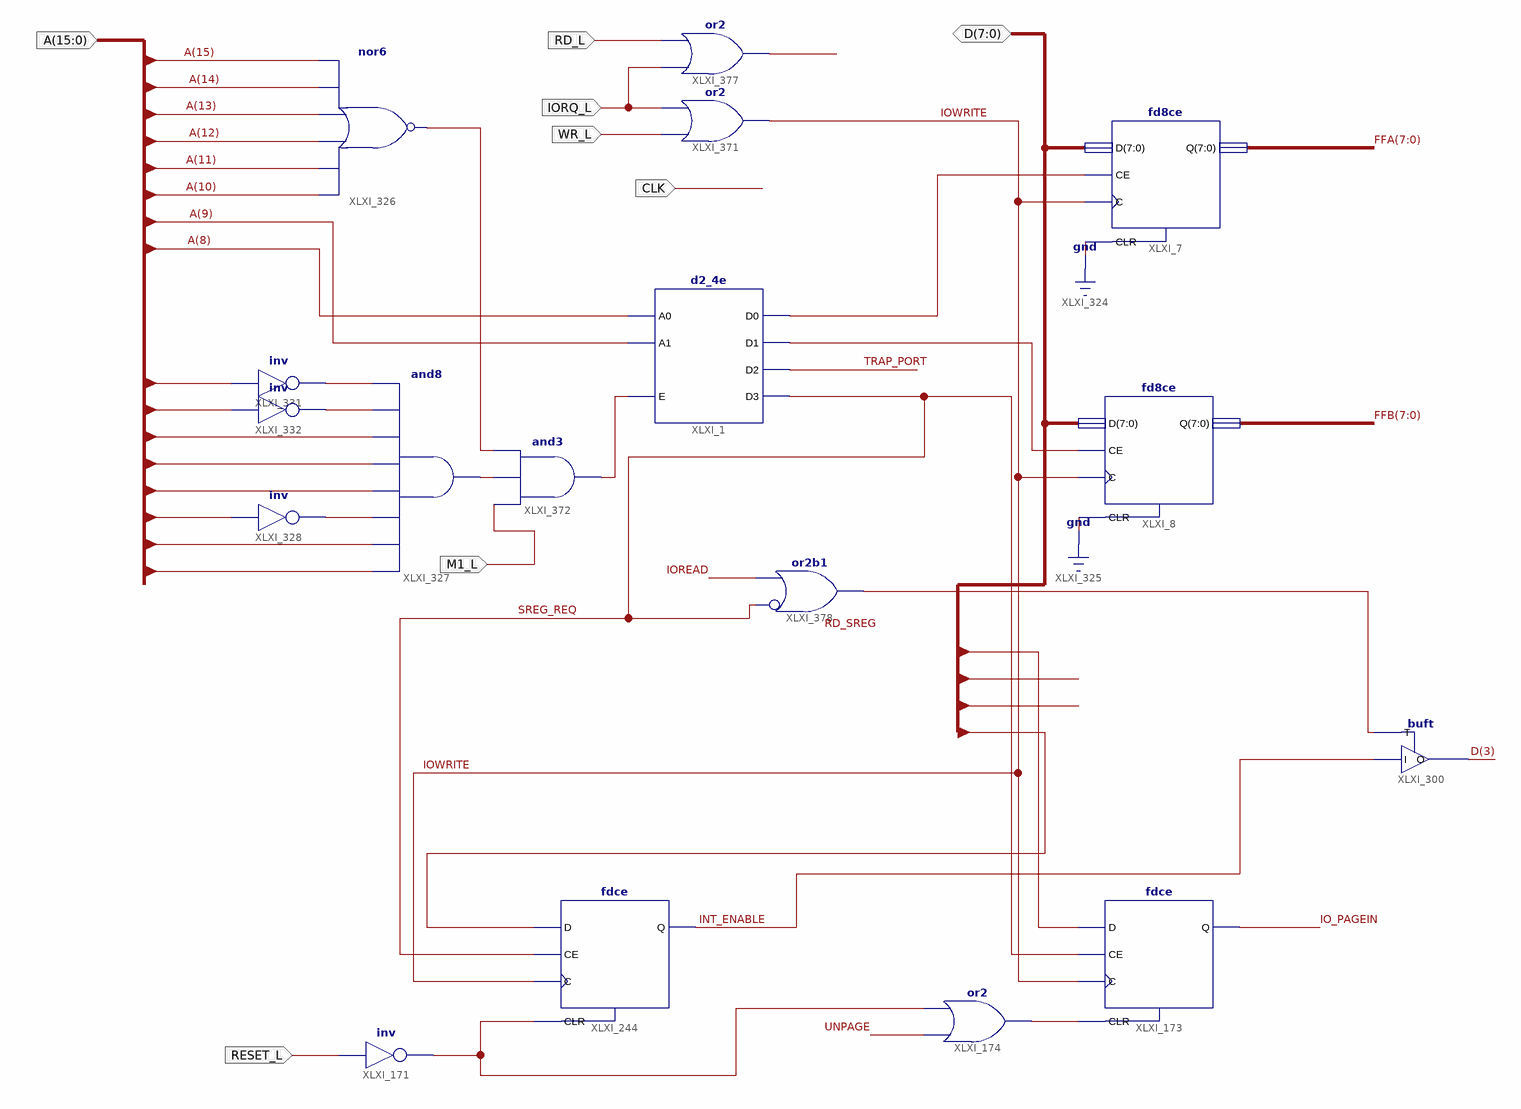
[diagram p0: schematic sheet 1]
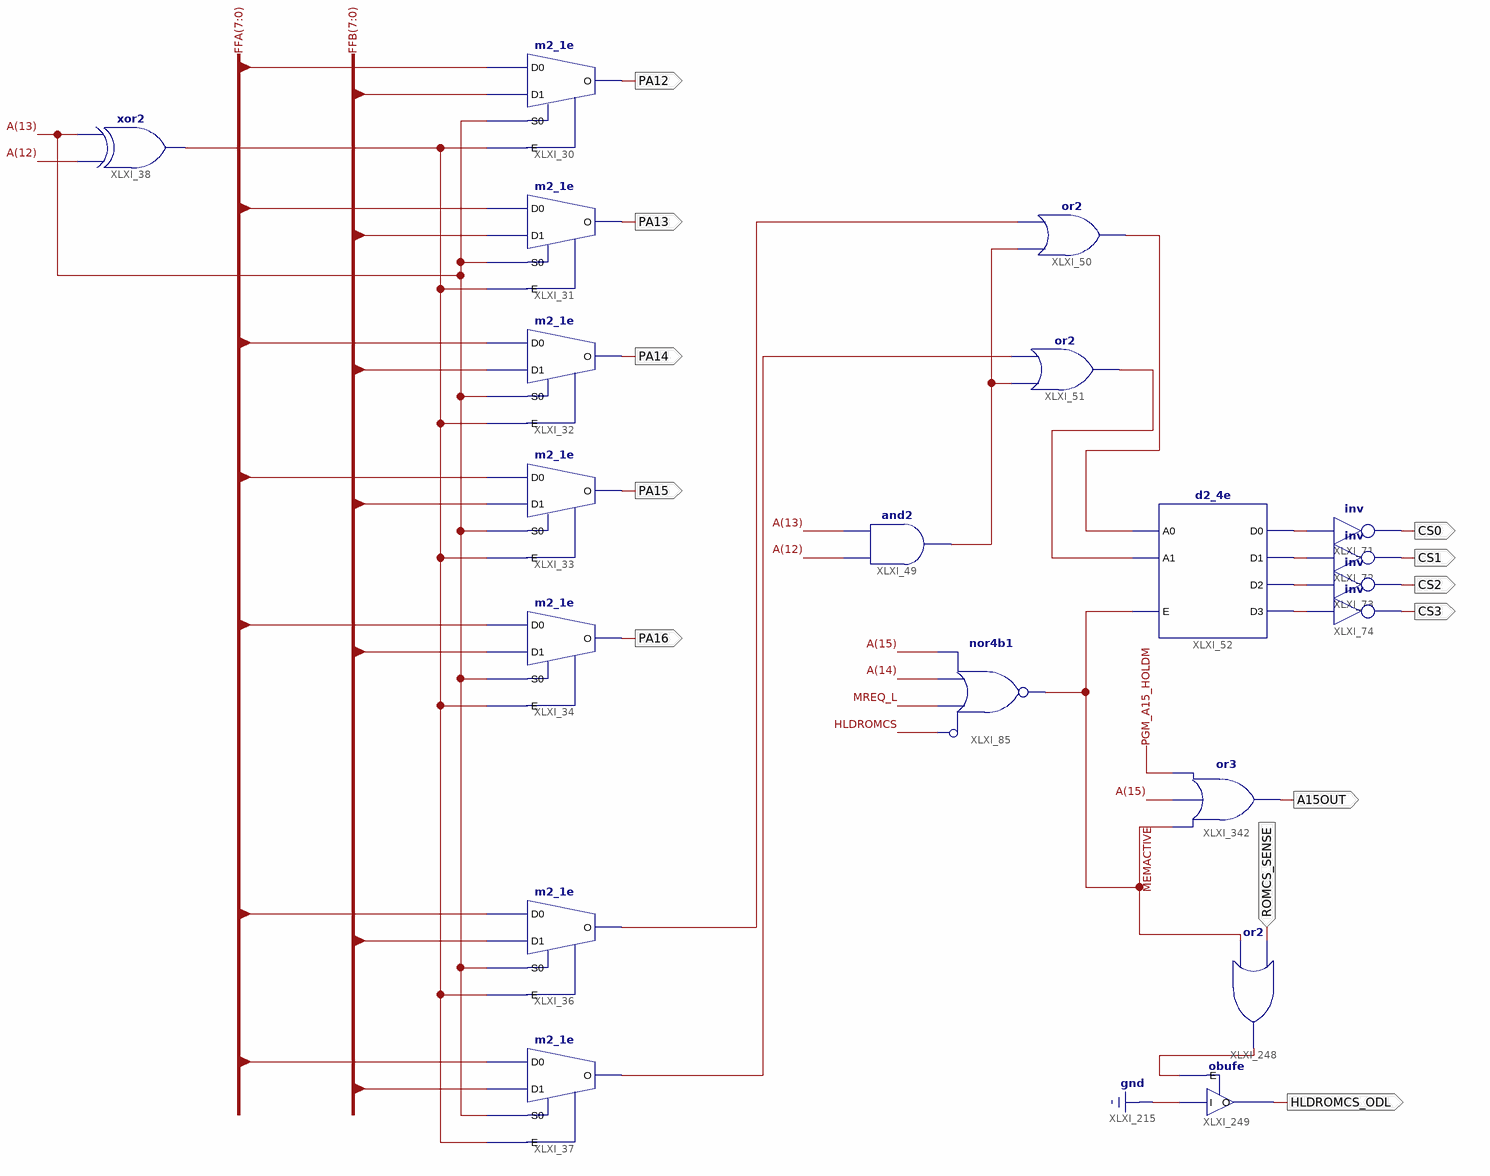
[diagram p1: schematic sheet 2]
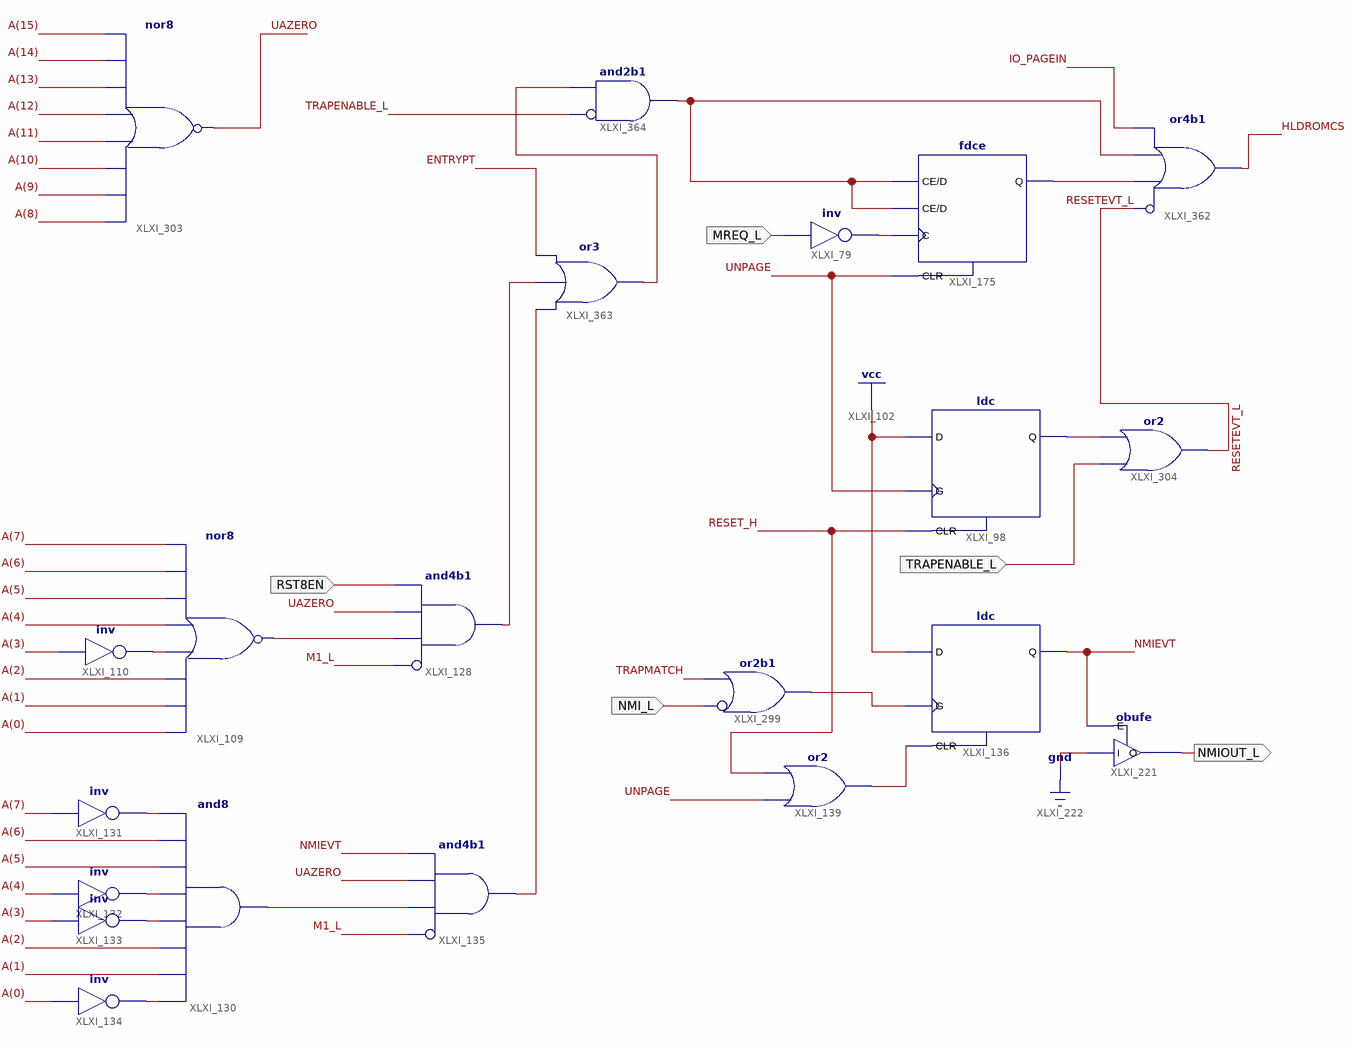
[diagram p2: schematic sheet 3]
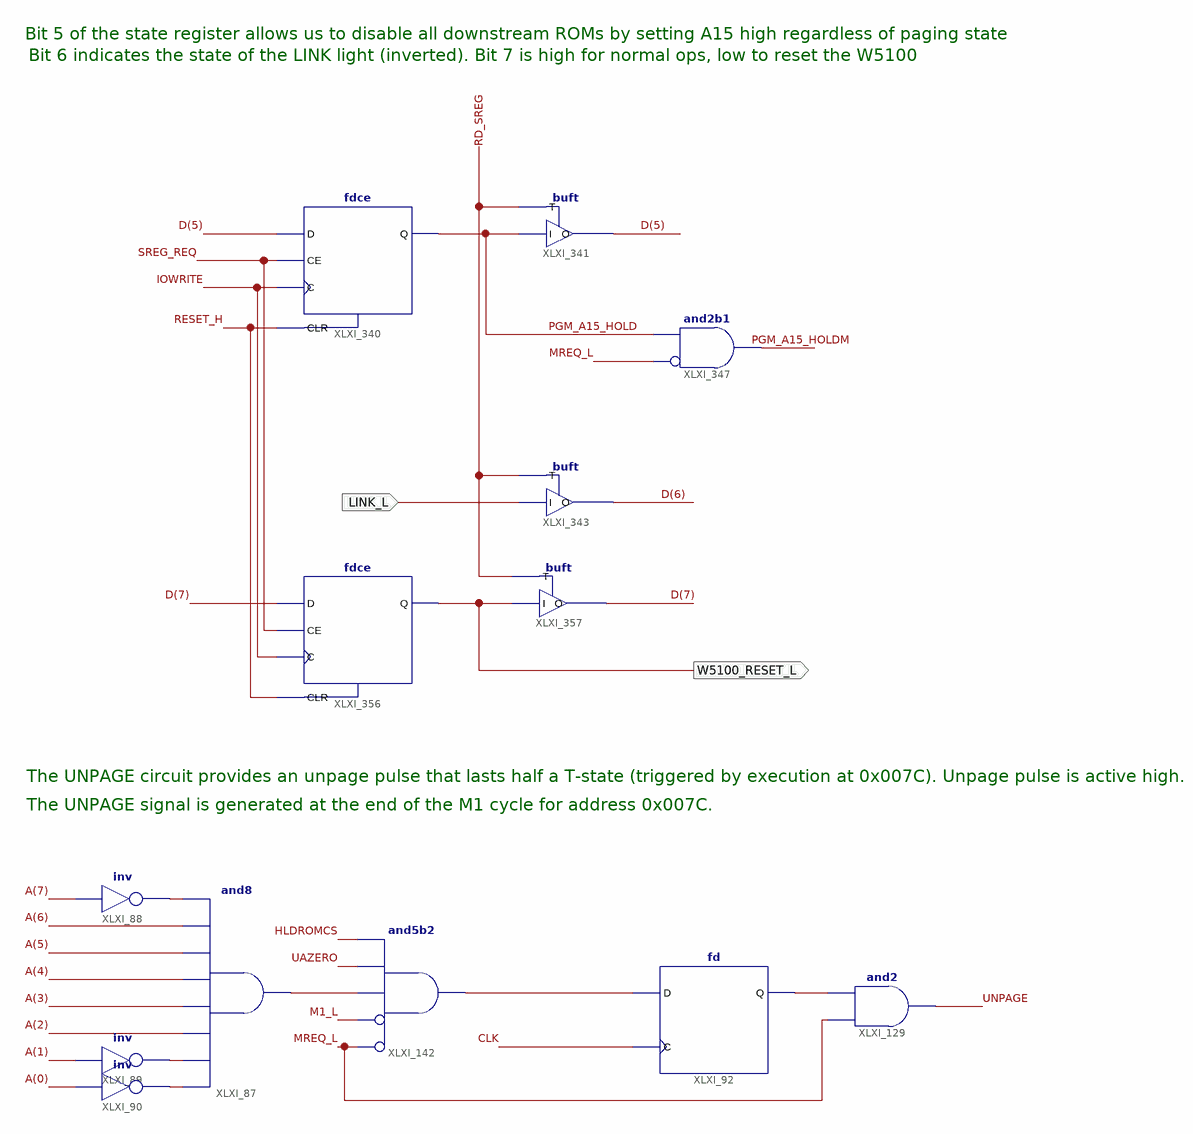
[diagram p3: schematic sheet 4]
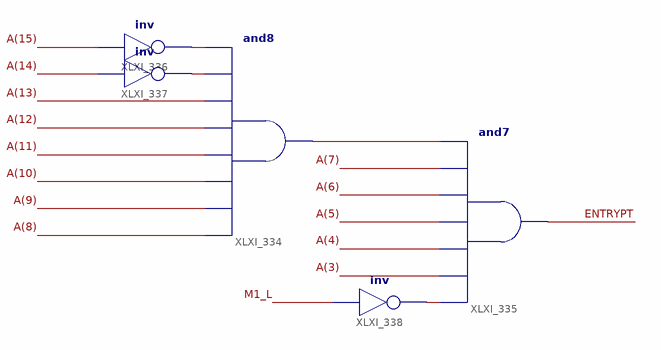
[diagram p4: schematic sheet 5]
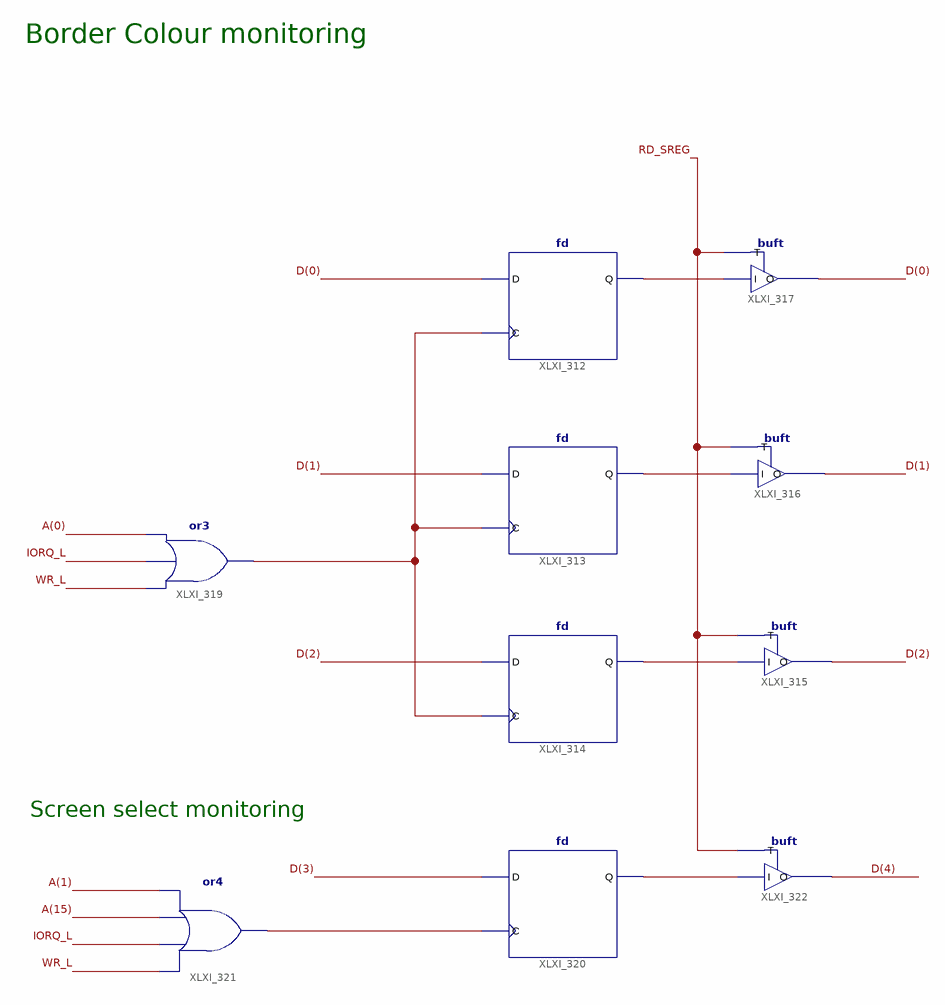
[diagram p5: schematic sheet 6]
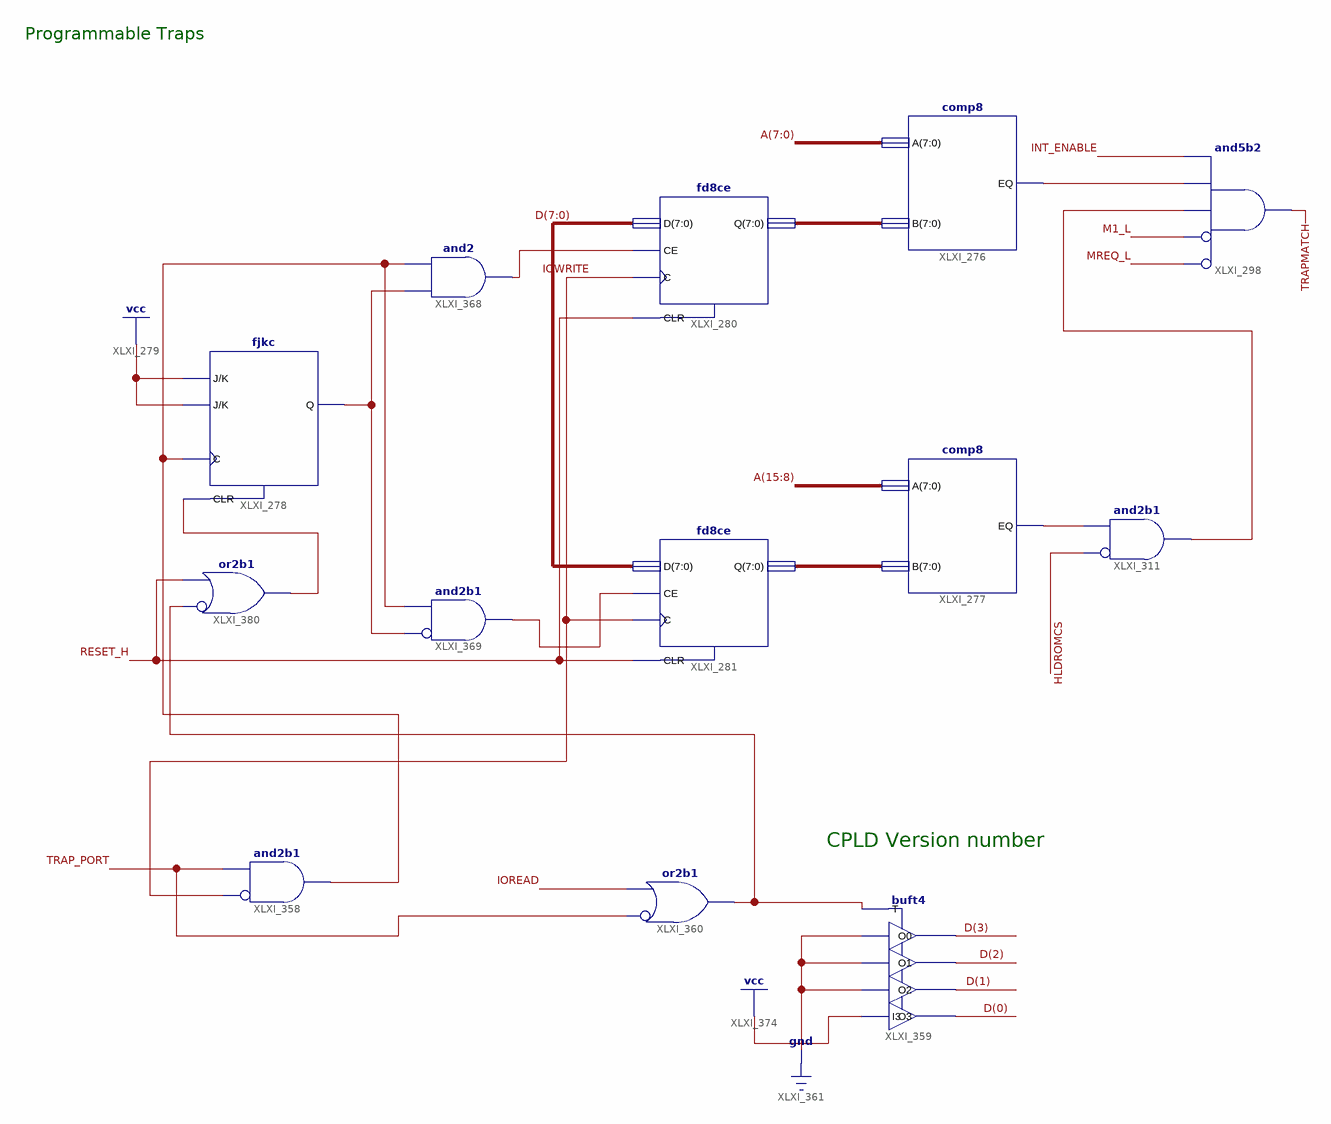
[diagram p6: schematic sheet 7]
// Xilinx ISE schematic spectranet.sch (xc9500xl) as structural Verilog: 99 symbols, 27 ports
module spectranet (
  input  M1_L,
  input  CLK,
  input  MREQ_L,
  input  RST8EN,
  input  NMI_L,
  input  IORQ_L,
  input  WR_L,
  input  TRAPENABLE_L,
  input  [15:0] A,
  input  RESET_L,
  input  RD_L,
  input  ROMCS_SENSE,
  input  LINK_L,
  inout  [7:0] D,
  output PA12,
  output PA13,
  output PA14,
  output PA15,
  output PA16,
  output CS0,
  output CS1,
  output CS2,
  output CS3,
  output NMIOUT_L,
  output HLDROMCS_ODL,
  output A15OUT,
  output W5100_RESET_L
);

  wire ENTRYPT, HLDROMCS, INT_ENABLE, IO_PAGEIN, IOREAD, IOWRITE, MATCH_LO, MEMACTIVE, NMIEVT, PA18, PA19,
       PGM_A15_HOLD, PGM_A15_HOLDM, RD_SREG, RESET_H, RESETEVT_L, SREG_REQ, TRAP_PORT, TRAPMATCH, UAZERO,
       UNPAGE, XLXN_145, XLXN_159, XLXN_202, XLXN_203, XLXN_205, XLXN_206, XLXN_207, XLXN_208, XLXN_228,
       XLXN_261, XLXN_262, XLXN_263, XLXN_267, XLXN_270, XLXN_275, XLXN_328, XLXN_364, XLXN_366, XLXN_369,
       XLXN_370, XLXN_371, XLXN_372, XLXN_381, XLXN_394, XLXN_481, XLXN_482, XLXN_515, XLXN_562, XLXN_595,
       XLXN_650, XLXN_659, XLXN_664, XLXN_667, XLXN_684, XLXN_686, XLXN_689, XLXN_690, XLXN_692, XLXN_693,
       XLXN_694, XLXN_695, XLXN_696, XLXN_714, XLXN_716, XLXN_720, XLXN_722, XLXN_724, XLXN_725, XLXN_726,
       XLXN_735, XLXN_761, XLXN_771, XLXN_773, XLXN_779, XLXN_784, XLXN_785, XLXN_791, XLXN_805;
  wire [7:0] FFA, FFB, XLXN_630, XLXN_631;

  m2_1e XLXI_30 (.D0(FFA[0]), .D1(FFB[0]), .E(XLXN_145), .S0(A[13]), .O(PA12));
  m2_1e XLXI_31 (.D0(FFA[1]), .D1(FFB[1]), .E(XLXN_145), .S0(A[13]), .O(PA13));
  m2_1e XLXI_32 (.D0(FFA[2]), .D1(FFB[2]), .E(XLXN_145), .S0(A[13]), .O(PA14));
  m2_1e XLXI_33 (.D0(FFA[3]), .D1(FFB[3]), .E(XLXN_145), .S0(A[13]), .O(PA15));
  m2_1e XLXI_34 (.D0(FFA[4]), .D1(FFB[4]), .E(XLXN_145), .S0(A[13]), .O(PA16));
  m2_1e XLXI_36 (.D0(FFA[6]), .D1(FFB[6]), .E(XLXN_145), .S0(A[13]), .O(PA18));
  m2_1e XLXI_37 (.D0(FFA[7]), .D1(FFB[7]), .E(XLXN_145), .S0(A[13]), .O(PA19));
  d2_4e XLXI_52 (
    .A0(XLXN_203), .A1(XLXN_202), .E(MEMACTIVE), .D0(XLXN_205), .D1(XLXN_206), .D2(XLXN_207), .D3(XLXN_208));
  xor XLXI_38 (XLXN_145, A[12], A[13]);
  not XLXI_71 (CS0, XLXN_205);
  not XLXI_72 (CS1, XLXN_206);
  not XLXI_73 (CS2, XLXN_207);
  not XLXI_74 (CS3, XLXN_208);
  nor XLXI_85 (MEMACTIVE, ~HLDROMCS, MREQ_L, A[14], A[15]);  // nor4b1
  nor XLXI_109 (XLXN_366, A[0], A[1], A[2], XLXN_328, A[4], A[5], A[6], A[7]);
  not XLXI_110 (XLXN_328, A[3]);
  not XLXI_79 (XLXN_228, MREQ_L);
  ldc XLXI_98 (.G(UNPAGE), .CLR(RESET_H), .D(1'b1), .Q(XLXN_664));
  and XLXI_128 (XLXN_364, ~M1_L, XLXN_366, UAZERO, RST8EN);  // and4b1
  and XLXI_130 (XLXN_381, XLXN_372, A[1], A[2], XLXN_371, XLXN_370, A[5], A[6], XLXN_369);
  not XLXI_131 (XLXN_369, A[7]);
  not XLXI_132 (XLXN_370, A[4]);
  not XLXI_133 (XLXN_371, A[3]);
  not XLXI_134 (XLXN_372, A[0]);
  and XLXI_135 (XLXN_394, ~M1_L, XLXN_381, UAZERO, NMIEVT);  // and4b1
  ldc XLXI_136 (.G(XLXN_659), .CLR(XLXN_562), .D(1'b1), .Q(NMIEVT));
  or XLXI_139 (XLXN_562, UNPAGE, RESET_H);
  fd8ce XLXI_7 (.C(IOWRITE), .CE(XLXN_779), .CLR(1'b0), .D(D), .Q(FFA));
  fd8ce XLXI_8 (.C(IOWRITE), .CE(XLXN_515), .CLR(1'b0), .D(D), .Q(FFB));
  fdce XLXI_173 (.C(IOWRITE), .CE(SREG_REQ), .CLR(XLXN_481), .D(D[0]), .Q(IO_PAGEIN));
  or XLXI_174 (XLXN_481, UNPAGE, RESET_H);
  fdce XLXI_175 (.C(XLXN_228), .CE(XLXN_482), .CLR(UNPAGE), .D(XLXN_482), .Q(XLXN_667));
  d2_4e XLXI_1 (.A0(A[8]), .A1(A[9]), .E(XLXN_773), .D0(XLXN_779), .D1(XLXN_515), .D2(TRAP_PORT), .D3(SREG_REQ));
  obufe XLXI_221 (.E(NMIEVT), .I(1'b0), .O(NMIOUT_L));
  fdce XLXI_244 (.C(IOWRITE), .CE(SREG_REQ), .CLR(RESET_H), .D(D[3]), .Q(INT_ENABLE));
  and XLXI_49 (XLXN_159, A[12], A[13]);
  or XLXI_51 (XLXN_202, XLXN_159, PA19);
  or XLXI_50 (XLXN_203, XLXN_159, PA18);
  comp8 XLXI_276 (.A(A[7:0]), .B(XLXN_630), .EQ(MATCH_LO));
  comp8 XLXI_277 (.A(A[15:8]), .B(XLXN_631), .EQ(XLXN_686));
  fd8ce XLXI_280 (.C(IOWRITE), .CE(XLXN_784), .CLR(RESET_H), .D(D), .Q(XLXN_630));
  fd8ce XLXI_281 (.C(IOWRITE), .CE(XLXN_785), .CLR(RESET_H), .D(D), .Q(XLXN_631));
  fjkc XLXI_278 (.C(XLXN_761), .CLR(XLXN_791), .J(1'b1), .K(1'b1), .Q(XLXN_650));
  and XLXI_298 (TRAPMATCH, ~MREQ_L, ~M1_L, XLXN_689, MATCH_LO, INT_ENABLE);  // and5b2
  or XLXI_299 (XLXN_659, ~NMI_L, TRAPMATCH);  // or2b1
  buft XLXI_300 (.I(INT_ENABLE), .T(RD_SREG), .O(D[3]));
  nor XLXI_303 (UAZERO, A[8], A[9], A[10], A[11], A[12], A[13], A[14], A[15]);
  or XLXI_304 (RESETEVT_L, TRAPENABLE_L, XLXN_664);
  and XLXI_311 (XLXN_689, ~HLDROMCS, XLXN_686);  // and2b1
  fd XLXI_312 (.C(XLXN_690), .D(D[0]), .Q(XLXN_692));
  fd XLXI_313 (.C(XLXN_690), .D(D[1]), .Q(XLXN_693));
  fd XLXI_314 (.C(XLXN_690), .D(D[2]), .Q(XLXN_694));
  buft XLXI_315 (.I(XLXN_694), .T(RD_SREG), .O(D[2]));
  buft XLXI_316 (.I(XLXN_693), .T(RD_SREG), .O(D[1]));
  buft XLXI_317 (.I(XLXN_692), .T(RD_SREG), .O(D[0]));
  or XLXI_319 (XLXN_690, WR_L, IORQ_L, A[0]);
  fd XLXI_320 (.C(XLXN_695), .D(D[3]), .Q(XLXN_696));
  or XLXI_321 (XLXN_695, WR_L, IORQ_L, A[15], A[1]);
  buft XLXI_322 (.I(XLXN_696), .T(RD_SREG), .O(D[4]));
  not XLXI_171 (RESET_H, RESET_L);
  nor XLXI_326 (XLXN_684, A[10], A[11], A[12], A[13], A[14], A[15]);
  and XLXI_327 (XLXN_716, A[0], A[1], XLXN_714, A[3], A[4], A[5], XLXN_722, XLXN_720);
  not XLXI_328 (XLXN_714, A[2]);
  not XLXI_331 (XLXN_720, A[7]);
  not XLXI_332 (XLXN_722, A[6]);
  and XLXI_334 (XLXN_735, A[8], A[9], A[10], A[11], A[12], A[13], XLXN_725, XLXN_724);
  and XLXI_335 (ENTRYPT, XLXN_726, A[3], A[4], A[5], A[6], A[7], XLXN_735);
  not XLXI_336 (XLXN_724, A[15]);
  not XLXI_337 (XLXN_725, A[14]);
  not XLXI_338 (XLXN_726, M1_L);
  obufe XLXI_249 (.E(XLXN_595), .I(1'b0), .O(HLDROMCS_ODL));
  or XLXI_248 (XLXN_595, MEMACTIVE, ROMCS_SENSE);
  fdce XLXI_340 (.C(IOWRITE), .CE(SREG_REQ), .CLR(RESET_H), .D(D[5]), .Q(PGM_A15_HOLD));
  buft XLXI_341 (.I(PGM_A15_HOLD), .T(RD_SREG), .O(D[5]));
  or XLXI_342 (A15OUT, MEMACTIVE, A[15], PGM_A15_HOLDM);
  buft XLXI_343 (.I(LINK_L), .T(RD_SREG), .O(D[6]));
  and XLXI_347 (PGM_A15_HOLDM, ~MREQ_L, PGM_A15_HOLD);  // and2b1
  and XLXI_87 (XLXN_267, XLXN_263, XLXN_262, A[2], A[3], A[4], A[5], A[6], XLXN_261);
  not XLXI_88 (XLXN_261, A[7]);
  not XLXI_89 (XLXN_262, A[1]);
  not XLXI_90 (XLXN_263, A[0]);
  and XLXI_142 (XLXN_270, ~MREQ_L, ~M1_L, XLXN_267, UAZERO, HLDROMCS);  // and5b2
  fd XLXI_92 (.C(CLK), .D(XLXN_270), .Q(XLXN_275));
  and XLXI_129 (UNPAGE, MREQ_L, XLXN_275);
  fdce XLXI_356 (.C(IOWRITE), .CE(SREG_REQ), .CLR(RESET_H), .D(D[7]), .Q(W5100_RESET_L));
  buft XLXI_357 (.I(W5100_RESET_L), .T(RD_SREG), .O(D[7]));
  and XLXI_358 (XLXN_761, ~IOWRITE, TRAP_PORT);  // and2b1
  buft4 XLXI_359 (.I0(1'b0), .I1(1'b0), .I2(1'b0), .I3(1'b1), .T(XLXN_805), .O0(D[3]), .O1(D[2]), .O2(D[1]), .O3(D[0]));
  or XLXI_360 (XLXN_805, ~TRAP_PORT, IOREAD);  // or2b1
  or XLXI_362 (HLDROMCS, ~RESETEVT_L, XLXN_667, XLXN_482, IO_PAGEIN);  // or4b1
  or XLXI_363 (XLXN_771, XLXN_394, XLXN_364, ENTRYPT);
  and XLXI_364 (XLXN_482, ~TRAPENABLE_L, XLXN_771);  // and2b1
  and XLXI_368 (XLXN_784, XLXN_650, XLXN_761);
  and XLXI_369 (XLXN_785, ~XLXN_650, XLXN_761);  // and2b1
  or XLXI_371 (IOWRITE, WR_L, IORQ_L);
  and XLXI_372 (XLXN_773, M1_L, XLXN_716, XLXN_684);
  or XLXI_377 (IOREAD, IORQ_L, RD_L);
  or XLXI_378 (RD_SREG, ~SREG_REQ, IOREAD);  // or2b1
  or XLXI_380 (XLXN_791, ~XLXN_805, RESET_H);  // or2b1

  // Notes on the sheet:
  //   Bit 5 of the state register allows us to disable all downstream ROMs by setting A15 high regardless of paging state
  //   Bit 6 indicates the state of the LINK light (inverted). Bit 7 is high for normal ops, low to reset the W5100
  //   The UNPAGE circuit provides an unpage pulse that lasts half a T-state (triggered by execution at 0x007C). Unpage pulse is active high.
  //   The UNPAGE signal is generated at the end of the M1 cycle for address 0x007C.
  //   Border Colour monitoring
  //   Screen select monitoring
  //   Programmable Traps
  //   CPLD Version number
  //   BUFG on signal CLK = CLK
endmodule
